# Altium schematic sheet ShemaMiniM4.SchDoc
size A
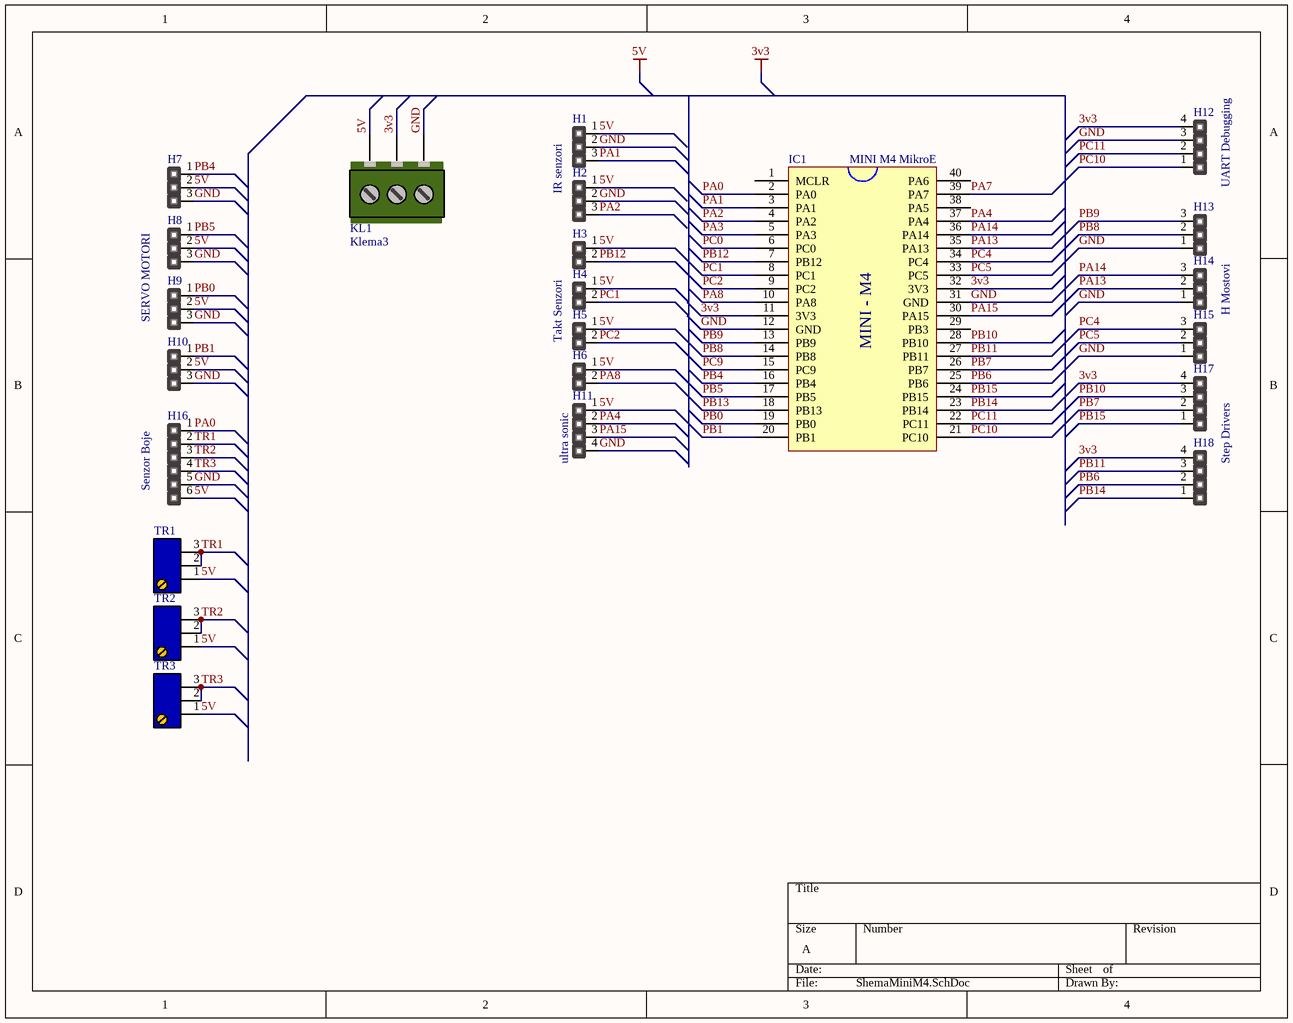
[diagram p0: ShemaMiniM4.SchDoc]

## Parts
H1  Header 1x3  [Header 1x3]  (value not drawn)
H2  Header 1x3  [Header 1x3]  (value not drawn)
H3  Header1x2  [Header1x2]  (value not drawn)
H4  Header1x2  [Header1x2]  (value not drawn)
H5  Header1x2  [Header1x2]  (value not drawn)
H6  Header1x2  [Header1x2]  (value not drawn)
H7  Header 1x3  [Header 1x3]  (value not drawn)
H8  Header 1x3  [Header 1x3]  (value not drawn)
H9  Header 1x3  [Header 1x3]  (value not drawn)
H10  Header 1x3  [Header 1x3]  (value not drawn)
H11  Header1x4  [Header1x4]  (value not drawn)
H12  Header1x4  [Header1x4]  (value not drawn)
H13  Header 1x3  [Header 1x3]  (value not drawn)
H14  Header 1x3  [Header 1x3]  (value not drawn)
H15  Header 1x3  [Header 1x3]  (value not drawn)
H16  Header1x6  [Header1x6]  (value not drawn)
H17  Header1x4  [Header1x4]  (value not drawn)
H18  Header1x4  [Header1x4]  (value not drawn)
IC1  MINI M4 MikroE  [DIP40]
KL1  Klema3  [Klema3]
TR1  TRIM  [TRIM]  (value not drawn)
TR2  TRIM  [TRIM]  (value not drawn)
TR3  TRIM  [TRIM]  (value not drawn)

## Nets
3v3: H12.4 H17.4 H18.4 IC1.11(3V3) IC1.32(3V3) KL1.2
5V: H1.1 H2.1 H3.1 H4.1 H5.1 H6.1 H7.2 H8.2 H9.2 H10.2 H11.1 H16.6 KL1.3 TR1.1 TR2.1 TR3.1
GND: H1.2 H2.2 H7.3 H8.3 H9.3 H10.3 H11.4 H12.3 H13.1 H14.1 H15.1 H16.5 IC1.12(GND) IC1.31(GND) KL1.1
PA0: H16.1 IC1.2(PA0)
PA1: H1.3 IC1.3(PA1)
PA2: H2.3 IC1.4(PA2)
PA3: IC1.5(PA3)
PA4: H11.2 IC1.37(PA4)
PA7: IC1.39(PA7)
PA8: H6.2 IC1.10(PA8)
PA13: H14.2 IC1.35(PA13)
PA14: H14.3 IC1.36(PA14)
PA15: H11.3 IC1.30(PA15)
PB0: H9.1 IC1.19(PB0)
PB1: H10.1 IC1.20(PB1)
PB4: H7.1 IC1.16(PB4)
PB5: H8.1 IC1.17(PB5)
PB6: H18.2 IC1.25(PB6)
PB7: H17.2 IC1.26(PB7)
PB8: H13.2 IC1.14(PB8)
PB9: H13.3 IC1.13(PB9)
PB10: H17.3 IC1.28(PB10)
PB11: H18.3 IC1.27(PB11)
PB12: H3.2 IC1.7(PB12)
PB13: IC1.18(PB13)
PB14: H18.1 IC1.23(PB14)
PB15: H17.1 IC1.24(PB15)
PC0: IC1.6(PC0)
PC1: H4.2 IC1.8(PC1)
PC2: H5.2 IC1.9(PC2)
PC4: H15.3 IC1.34(PC4)
PC5: H15.2 IC1.33(PC5)
PC9: IC1.15(PC9)
PC10: H12.1 IC1.21(PC10)
PC11: H12.2 IC1.22(PC11)
TR1: H16.2 TR1.2 TR1.3
TR2: H16.3 TR2.2 TR2.3
TR3: H16.4 TR3.2 TR3.3

Not connected (* = marked no-connect by the designer): IC1 1(MCLR) 29(PB3) 38(PA5) 40(PA6)

## Notes on the sheet
- IR senzori
- (near H12) UART Debugging
- SERVO MOTORI
- Takt Senzori
- H Mostovi
- (near H16) Senzor Boje
- (near H11) ultra sonic
- Step Drivers
- (in symbol MINI M4 MikroE) MINI - M4